# EAGLE design MainControl Board (EAGLE 8.6.0)
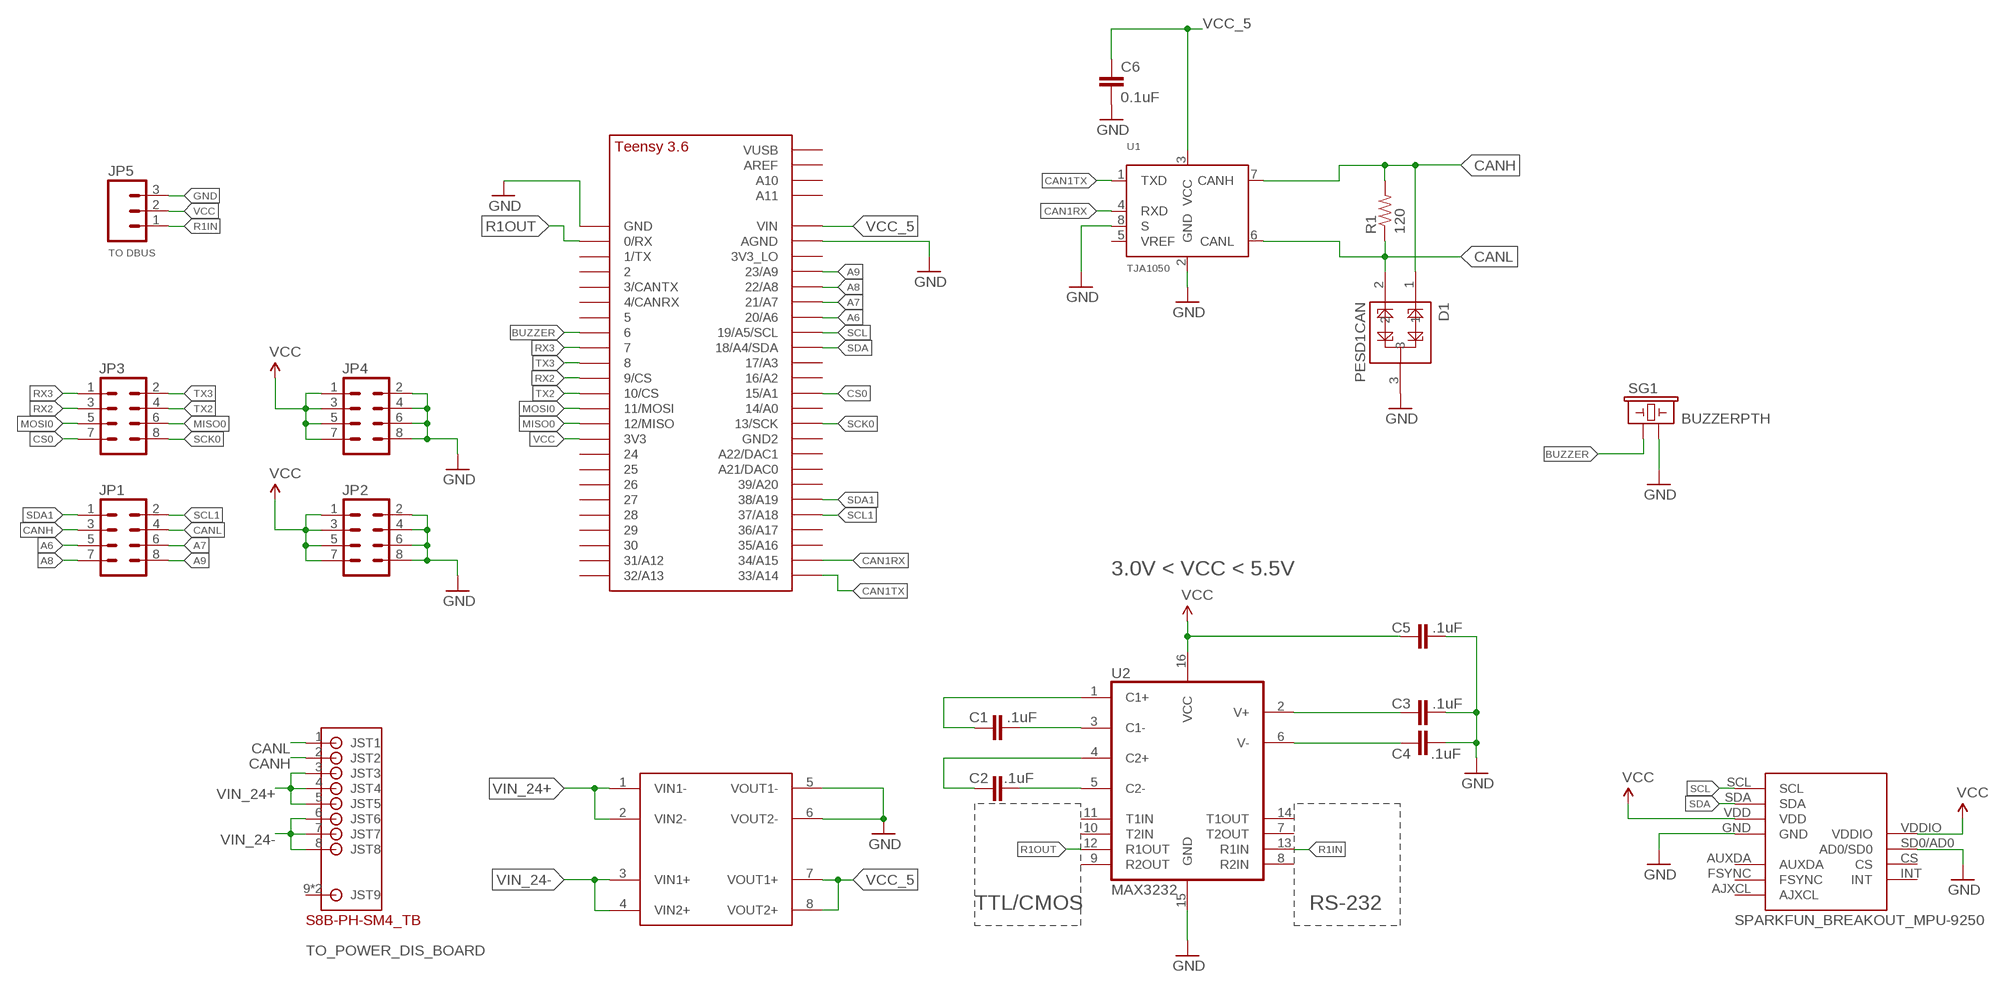
[diagram p0: schematic, sheet 1]

## Parts
C1  .1uF  0.1UF-25V(+80/-20%)(0603)  [0603-CAP]
C2  .1uF  0.1UF-25V(+80/-20%)(0603)  [0603-CAP]
C3  .1uF  0.1UF-25V(+80/-20%)(0603)  [0603-CAP]
C4  .1uF  0.1UF-25V(+80/-20%)(0603)  [0603-CAP]
C5  .1uF  0.1UF-25V(+80/-20%)(0603)  [0603-CAP]
C6  0.1uF  0.1UF-25V(+80/-20%)(0603)  [0603-CAP]
D1  PESD1CAN  [SOT23-3]
JP1  M04X2  [2X4]
JP2  M04X2  [2X4]
JP3  M04X2  [2X4]
JP4  M04X2  [2X4]
JP5  M03JST-PTH-VERT  [JST-3-PTH-VERT]
R1  120  0.22OHM-1/4W-1%(0805)  [0805]
SG1  BUZZERPTH  [BUZZER-12MM]
U1  TJA1050  [SOT96-1]
U2  MAX3232  MAX232SOIC16  [SO016]
U$1  TEENSY_3.5/3.6_BASIC  [TEENSY_3.5/3.6_BASIC]
U$2  MP1584  [MP1584_AMAZON]
U$3  S8B-PH-SM4_TB  [S8B-PH-SM4_TB]
U$4  SPARKFUN_BREAKOUT_MPU-9250  [SPARKFUN_BREAKOUT_MPU-9250]

## Nets
A6: JP1.5 U$1.20/A6
A7: JP1.6 U$1.21/A7
A8: JP1.7 U$1.22/A8
A9: JP1.8 U$1.23/A9
BUZZER: SG1.+ U$1.6
C1+: C1.1 U2.1(C1+)
C1-: C1.2 U2.3(C1-)
C2+: C2.1 U2.4(C2+)
C2-: C2.2 U2.5(C2-)
CAN1RX: U1.4(RXD) U$1.34/A15
CAN1TX: U1.1(TXD) U$1.33/A14
CANH: D1.1 JP1.3 R1.2 U1.7(CANH) U$3.2(JST2)
CANL: D1.2 JP1.4 R1.1 U1.6(CANL) U$3.1(JST1)
CS0: JP3.7 U$1.15/A1
GND: C3.2 C4.2 C5.2 C6.2 D1.3 JP2.2 JP2.4 JP2.6 JP2.8 JP4.2 JP4.4 JP4.6 JP4.8 JP5.3 SG1.- U1.2(GND) U1.8(S) U2.15(GND) U$1.AGND U$1.GND U$2.5(VOUT1-) U$2.6(VOUT2-) U$4.GND U$4.SD0/AD0(AD0/SD0)
MISO0: JP3.6 U$1.12/MISO
MOSI0: JP3.5 U$1.11/MOSI
R1IN: JP5.1 U2.13(R1IN)
R1OUT: U2.12(R1OUT) U$1.0/RX
RX2: JP3.3 U$1.9/CS
RX3: JP3.1 U$1.7
SCK0: JP3.8 U$1.13/SCK
SCL: U$1.19/A5/SCL U$4.SCL
SCL1: JP1.2 U$1.37/A18
SDA: U$1.18/A4/SDA U$4.SDA
SDA1: JP1.1 U$1.38/A19
TX2: JP3.4 U$1.10/CS
TX3: JP3.2 U$1.8
V+: C3.1 U2.2(V+)
V-: C4.1 U2.6(V-)
VCC: C5.1 JP2.1 JP2.3 JP2.5 JP2.7 JP4.1 JP4.3 JP4.5 JP4.7 JP5.2 U2.16(VCC) U$1.3V3 U$4.VDD U$4.VDDIO
VCC_5: C6.1 U1.3(VCC) U$1.VIN U$2.7(VOUT1+) U$2.8(VOUT2+)
VIN_24+: U$2.1(VIN1-) U$2.2(VIN2-) U$3.3(JST3) U$3.4(JST4) U$3.5(JST5)
VIN_24-: U$2.3(VIN1+) U$2.4(VIN2+) U$3.6(JST6) U$3.7(JST7) U$3.8(JST8)
Unconnected: U1.5(VREF) U2.7(T2OUT) U2.8(R2IN) U2.9(R2OUT) U2.10(T2IN) U2.11(T1IN) U2.14(T1OUT) U$1.1/TX U$1.2 U$1.3/CANTX U$1.3V3_LO U$1.4/CANRX U$1.5 U$1.14/A0 U$1.16/A2 U$1.17/A3 U$1.21/DAC0(A21/DAC0) U$1.24 U$1.25 U$1.26 U$1.27 U$1.28 U$1.29 U$1.30 U$1.31/A12 U$1.32/A13 U$1.35/A16 U$1.36/A17 U$1.39/A20 U$1.A10 U$1.A11 U$1.A22/DAC1 U$1.AREF U$1.GND2 U$1.VUSB U$3.9(JST9) U$3.10(JST9) U$4.AJXCL U$4.AUXDA U$4.CS U$4.FSYNC U$4.INT

## Notes on the sheet
- TO DBUS
- 3.0V < VCC < 5.5V
- TTL/CMOS | RS-232
- TO_POWER_DIS_BOARD

## Library data of the parts
C1-C5 = SparkFun-Capacitors:0.1UF-25V(+80/-20%)(0603): CAP-00810 Ceramic Standard decoupling cap; PROD_ID: CAP-00810; SPARKLE_ID: 918; VALUE: 0.1uF
C6 = SparkFun-Capacitors:0.1UF-25V(+80/-20%)(0603): CAP-00810 Ceramic Standard decoupling cap; PROD_ID: CAP-00810
D1 = SparkFun-DiscreteSemi:PESD1CAN: PESD1CAN is used to protect two automotive CAN bus lines from ESD.; PROD_ID: DIO-12501
JP1-JP4 = SparkFun-Connectors:M04X2: .1" header, two rows of four.
JP5 = SparkFun-Connectors:M03: Header 3 Standard 3-pin 0.1" header. Use with straight break away headers (SKU : PRT-00116), right angle break away headers (PRT-00553), swiss pins (PRT-00743), machine pins (PRT-00117), and female headers (PRT-00115). Molex polarized connector foot print use with SKU : PRT-08232 with associated crimp pins and housings.
R1 = SparkFun-Resistors:0.22OHM-1/4W-1%(0805): RES-09883; PROD_ID: RES-09883; VALUE: 0.22
SG1 = SparkFun-Electromechanical:BUZZER: Buzzer 12mm Spark Fun Electronics SKU : Comp-Buzzer
U1 = TJA1050:TJA1050: High speed CAN transceiver The TJA1050 is the interface between the Controller Area Network (CAN) protocol controller and the physical bus. The device provides differential transmit capability to the bus and differential receive capability to the CAN controller. The TJA1050 is the third Philips high-speed CAN transceiver after the PCA82C250 and the PCA82C251. The most important differences are: Much lower electromagnetic emission due to optimal matching of the output signals CANH and CANL Improved behaviour in case of an unpowered node No standby mode. This makes the TJA1050 eminently suitable for use in nodes that are in a power-down situation in partially powered networks. AAL Eindhoven MK; AVAILABILITY: Unavailable; MF: NXP Semiconductors; MP: TJA1050; PACKAGE: None; PRICE: 0.32 USD
U2 = SparkFun-DigitalIC:MAX232: RS232 Transceiver Very common IC. This is generically called 'MAX232', but works with the 3V equivalent MAX3232 generic ICs. Field tested and mother approved. Spark Fun Electronics SKU : COM-00316 (DIP) and COM-00589 (SMD); PROD_ID: IC-08171
U$1 = Teensy356:TEENSY_3.5/3.6_BASIC
U$2 = MP1584BUCK:MP1584
U$3 = KevinMade:S8B-PH-SM4_TB
U$4 = KevinMade:SPARKFUN_BREAKOUT_MPU-9250

## Net classes
0 default: width 0.305 mm, drill 0.508 mm, clearance 0.254 mm

## Board
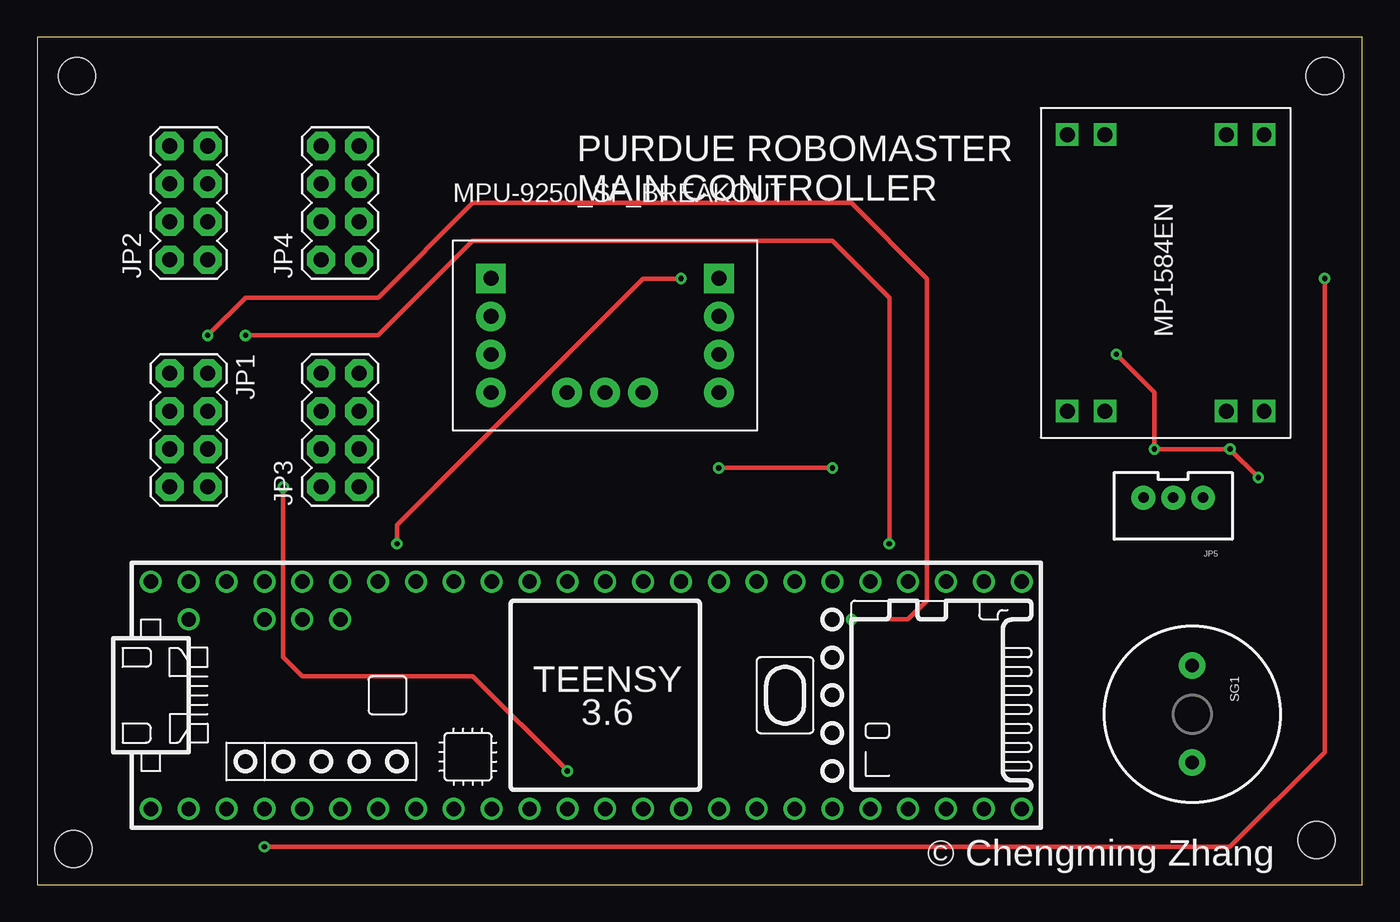
[diagram p1: board, top side]
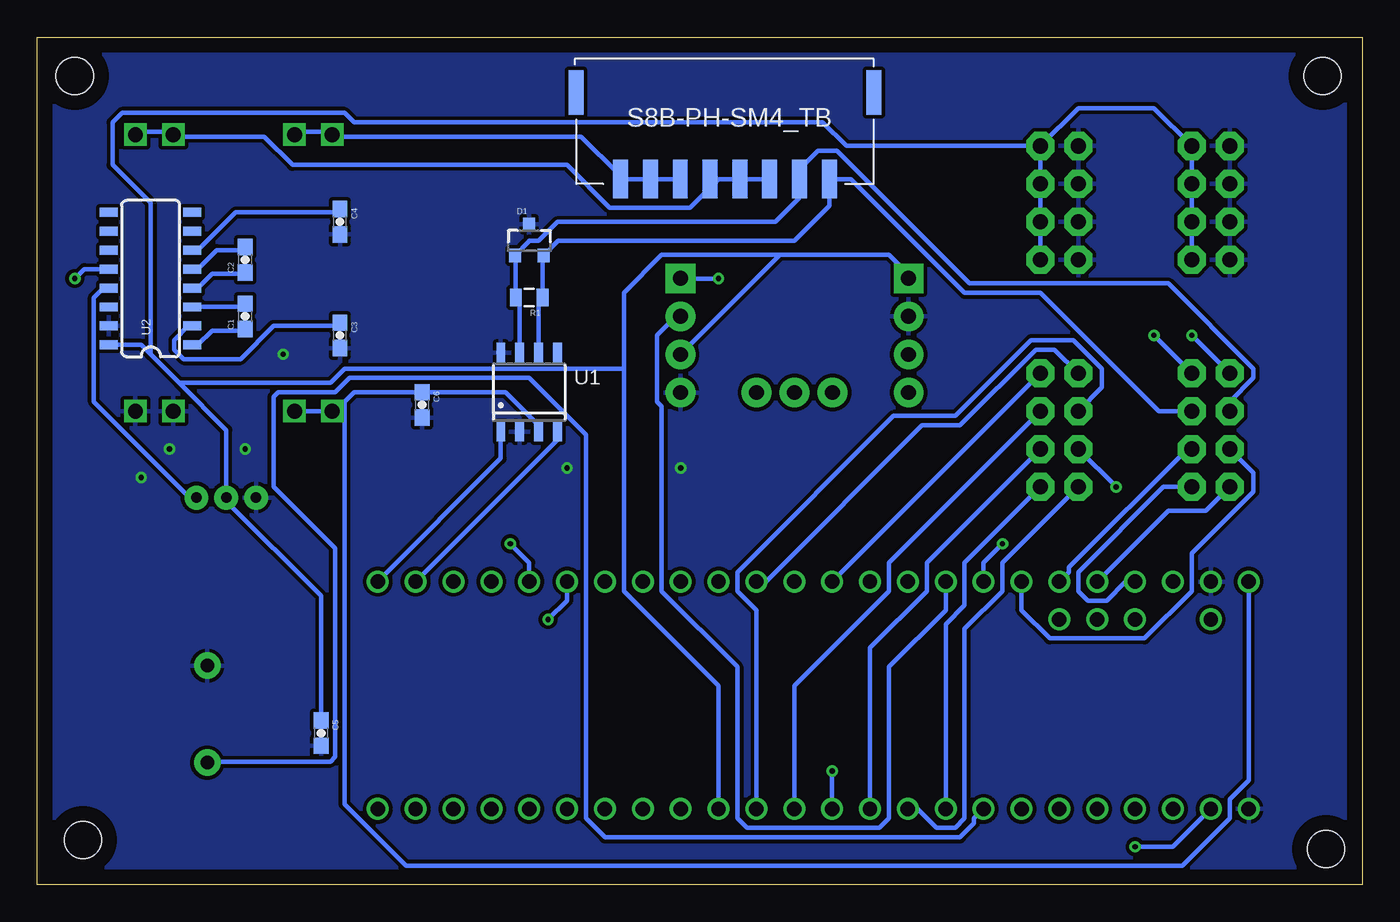
[diagram p2: board, bottom side, seen from below]

Size 88.88 x 56.82 mm. Coordinates in mm from the lower left corner, seen from the top.
Outline: 0,0 88.88,0 88.88,56.82 0,56.82 0,0
Copper layers (1*16): Top 0.035mm / dielectric 1.5mm / Bottom 0.035mm
Design rules "default *": minimum track width 6mil, minimum drill 0.35mm, track to track 10mil, track to pad 10mil, pad to pad 10mil, via to via 10mil, smd to smd 6mil, copper to edge 40mil, drill to drill 6mil, minimum pad ring 10mil, minimum via ring 8mil, stop-mask expansion 4mil, vias tented up to drill 0mil, thermal gap 10mil
Holes 2.5 mm at 2.43,2.39 85.81,2.99 2.67,54.23 86.36,54.23

### Footprints (pad centres in the part's own frame; a part is rotated, then mirrored left to right if it is on the bottom)
0603-CAP = smd 1.1 x 1: 1 -0.85,0; 2 0.85,0
SOT23-3 = smd 0.8 x 0.9: 1 -0.95,-1; 2 0.95,-1; 3 0,1.1
2X4 = drill 1.016 pad 1.88 octagon: 1 -3.81,-1.27; 2 -3.81,1.27; 3 -1.27,-1.27; 4 -1.27,1.27; 5 1.27,-1.27; 6 1.27,1.27; 7 3.81,-1.27; 8 3.81,1.27
JST-3-PTH-VERT = drill 0.7 pad 1.6: 1 -2,-0.55; 2 0,-0.55; 3 2,-0.55
0805 = smd 0.8 x 1.2: 1 -0.9,0; 2 0.9,0
BUZZER-12MM = drill 0.9 pad 1.778: + 3.25,0; - -3.25,0
SOT96-1 = smd 0.6 x 1.3: 1 -1.905,-2.65; 2 -0.635,-2.65; 3 0.635,-2.65; 4 1.905,-2.65; 5 1.905,2.65; 6 0.635,2.65; 7 -0.635,2.65; 8 -1.905,2.65
SO016 = smd 0.6 x 1.2: 1 -4.445,-2.8; 2 -3.175,-2.8; 3 -1.905,-2.8; 4 -0.635,-2.8; 5 0.635,-2.8; 6 1.905,-2.8; 7 3.175,-2.8; 8 4.445,-2.8; 9 4.445,2.8; 10 3.175,2.8; 11 1.905,2.8; 12 0.635,2.8; 13 -0.635,2.8; 14 -1.905,2.8; 15 -3.175,2.8; 16 -4.445,2.8
TEENSY_3.5/3.6_BASIC = drill 0.965: 0/RX -25.4,-7.62; 1/TX -22.86,-7.62; 2 -20.32,-7.62; 3/CANTX -17.78,-7.62; 3V3 7.62,-7.62; 3V3_LO -22.86,7.62; 4/CANRX -15.24,-7.62; 5 -12.7,-7.62; 6 -10.16,-7.62; 7 -7.62,-7.62; 8 -5.08,-7.62; 9/CS -2.54,-7.62; 10/CS 0,-7.62; 11/MOSI 2.54,-7.62; 12/MISO 5.08,-7.62; 13/SCK 5.08,7.62; 14/A0 2.54,7.62; 15/A1 0,7.62; 16/A2 -2.54,7.62; 17/A3 -5.08,7.62; 18/A4/SDA -7.62,7.62; 19/A5/SCL -10.16,7.62; 20/A6 -12.7,7.62; 21/A7 -15.24,7.62; 21/DAC0 12.7,7.62; 22/A8 -17.78,7.62; 23/A9 -20.32,7.62; 24 10.16,-7.62; 25 12.7,-7.62; 26 15.24,-7.62; 27 17.78,-7.62; 28 20.32,-7.62; 29 22.86,-7.62; 30 25.4,-7.62; 31/A12 27.94,-7.62; 32/A13 30.48,-7.62; 33/A14 30.48,7.62; 34/A15 27.94,7.62; 35/A16 25.4,7.62; 36/A17 22.86,7.62; 37/A18 20.32,7.62; 38/A19 17.78,7.62; 39/A20 15.24,7.62; A10 -17.78,5.08; A11 -15.24,5.08; A22/DAC1 10.16,7.62; AGND -25.4,7.62; AREF -20.32,5.08; GND -27.94,-7.62; GND2 7.62,7.62; VIN -27.94,7.62; VUSB -25.4,5.08
MP1584_AMAZON = drill 1 square: 1 1.778,14.986; 2 1.778,12.446; 3 1.778,4.318; 4 1.778,1.778; 5 20.32,14.986; 6 20.32,12.446; 7 20.32,4.318; 8 20.32,1.778
S8B-PH-SM4_TB = smd 1 x 2.6: 1 4,7.3; 2 6,7.3; 3 8,7.3; 4 10,7.3; 5 12,7.3; 6 14,7.3; 7 16,7.3; 8 18,7.3 | smd 1 x 3: 9 1.016,1.5; 10 20.984,1.5
SPARKFUN_BREAKOUT_MPU-9250 = drill 1 pad 2: AJXCL 5.1,-7.65; AUXDA 5.1,-2.55; CS 2.55,-12.75; FSYNC 5.1,-5.1; GND 5.1,2.55; INT 5.1,-12.75; SD0/AD0 0,-12.75; SDA 0,2.55; VDD 2.55,2.55 | drill 1 pad 2 square: SCL -2.55,2.55; VDDIO -2.55,-12.75

### Placement (x,y rotation side)
C1  74.93,38.1 90 bottom
C2  74.93,41.91 90 bottom
C3  68.58,36.83 270 bottom
C4  68.58,44.45 270 bottom
C5  69.85,10.16 270 bottom
C6  63.07,32.17 270 bottom
D1  55.88,43.18 0 bottom
JP1  10.16,30.48 270 top
JP2  10.16,45.72 90 top
JP3  20.32,30.48 90 top
JP4  20.32,45.72 90 top
JP5  76.2,25.4 180 top
R1  55.88,39.37 180 bottom
SG1  77.47,11.43 270 top
U1  55.88,33.02 0 bottom
U2  81.28,40.64 90 bottom
U$1  35.56,12.7 0 top
U$2  67.31,52.07 270 top
U$3  31.75,54.61 180 bottom
U$4  43.18,38.1 270 top

### Tracks (layer width: path | path; a pad name or v marks a point on that pad's centre or on a via)
A6
  Bottom 0.305: U$1.20/A6 22.86,18.41 20.95,16.51 14.61,16.51 11.43,19.68 11.43,22.22 7.3,26.35 7.3,27.62 JP1.5
A7
  Bottom 0.305: U$1.21/A7 19.68,20.95 19.68,21.27 11.75,29.21 JP1.6
A8
  Bottom 0.305: JP1.7 10.48,25.08 13.02,25.08 U$1.22/A8
A9
  Bottom 0.305: U$1.23/A9 15.88,20.32 17.14,19.05 18.41,19.05 19.05,19.68 19.05,20.95 13.34,26.67 JP1.8
BUZZER
  Bottom 0.305: U$1.6 26.04,4.45 26.04,4.13 26.99,3.17 50.8,3.17 52.07,4.45 52.07,30.16 55.88,33.97 62.4,33.97 62.4,33.98 67.94,33.98 68.9,33.02 72.71,33.02 73.03,32.7 73.03,26.67 68.9,22.54 68.9,8.57 69.22,8.26 77.47,8.26 SG1.+
C1+
  Bottom 0.305: U2.1 78.11,36.2 77.15,37.15 74.93,37.15 C1.1
C1-
  Bottom 0.305: U2.3 74.93,38.74 C1.2
C2+
  Bottom 0.305: U2.4 78.11,40.01 77.15,40.96 74.93,40.96 C2.1
C2-
  Bottom 0.305: U2.5 78.11,41.28 76.84,42.55 74.93,42.55 C2.2
CAN1RX
  Bottom 0.305: U1.4 53.98,29.84 U$1.34/A15
CAN1TX
  Bottom 0.305: U1.1 57.78,28.57 U$1.33/A14
CANH
  Bottom 0.305: JP1.3 8.89,32.38 7.3,33.97 7.3,34.61 13.02,40.32 26.35,40.32 35.24,49.21 36.51,49.21 37.46,48.26 37.46,47.62 U$3.2 37.75,46.07 39.37,44.45 53.98,44.45 55.24,43.18 55.88,43.18 55.88,43.13 D1.1 56.83,41.96 56.78,41.91 R1.2 56.52,39.11 U1.7
CANL
  Bottom 0.305: JP1.4 13.65,31.75 21.59,39.69 26.67,39.69 34.29,47.31 35.56,47.31 U$3.1 35.75,45.53 38.1,43.18 53.93,43.18 D1.2 54.98,42.13 R1.1 55.24,39.11 U1.6
CS0
  Bottom 0.305: JP3.7 U$1.15/A1
GND  (via drill 0.35)
  Top 0.305: v45.72,27.94 v53.34,27.94 | v81.92,27.3 v80.01,29.21 v74.93,29.21 74.93,33.02 v72.39,35.56
  pour Bottom: -1.27,57.15 -1.27,-1.27 90.17,-1.27 90.17,57.15
MISO0
  Bottom 0.305: U$1.12/MISO 40.64,18.41 41.91,19.68 41.91,20.95 31.43,31.43 27.3,31.43 22.22,36.51 19.37,36.51 17.46,34.61 17.46,33.34 JP3.6
MOSI0
  Bottom 0.305: U$1.11/MOSI 38.1,13.33 31.75,19.68 31.75,21.59 JP3.5
R1IN
  Bottom 0.305: U2.13 84.46,40.01 85.09,39.37 85.09,32.38 78.42,25.72 JP5.1
R1OUT  (via drill 0.35)
  Top 0.305: v15.24,2.54 80.01,2.54 86.36,8.89 v86.36,40.64
  Bottom 0.305: U$1.0/RX 12.7,2.54 v15.24,2.54 | v86.36,40.64 85.73,41.28 U2.12
RX2
  Bottom 0.305: U$1.9/CS 33.02,15.88 29.21,19.68 29.21,21.59 JP3.3
RX3
  Bottom 0.305: U$1.7 27.94,17.46 26.67,18.73 26.67,21.59 JP3.1
SCK0
  Bottom 0.305: U$1.13/SCK 40.01,20.32 29.53,30.8 26.99,30.8 21.91,35.88 20.64,35.88 JP3.8
SCL  (via drill 0.35)
  Top 0.305: v24.13,22.86 24.13,24.13 40.64,40.64 v43.18,40.64
  Bottom 0.305: U$1.19/A5/SCL 25.4,21.59 v24.13,22.86 | v43.18,40.64 U$4.SCL
SCL1  (via drill 0.35)
  Top 0.305: v57.15,22.86 57.15,39.37 53.34,43.18 29.21,43.18 22.86,36.83 v13.97,36.83
  Bottom 0.305: JP1.2 v13.97,36.83 | U$1.37/A18 55.88,21.59 v57.15,22.86
SDA
  Bottom 0.305: U$1.18/A4/SDA 27.94,18.41 31.75,14.61 31.75,4.45 32.38,3.81 41.27,3.81 41.91,4.45 41.91,14.61 46.99,19.68 46.99,32.07 47.31,32.38 47.31,36.83 46.04,38.1 U$4.SDA
SDA1  (via drill 0.35)
  Top 0.305: v54.61,17.78 58.42,17.78 59.69,19.05 59.69,40.64 54.61,45.72 29.21,45.72 22.86,39.37 13.97,39.37 v11.43,36.83
  Bottom 0.305: JP1.1 v11.43,36.83 | U$1.38/A19 53.34,19.05 v54.61,17.78
TX2  (via drill 0.35)
  Top 0.305: v35.56,7.62 29.21,13.97 17.78,13.97 16.51,15.24 v16.51,26.67
  Bottom 0.305: U$1.10/CS v35.56,7.62 | v16.51,26.67 JP3.4
TX3
  Bottom 0.305: U$1.8 29.84,5.08 28.57,3.81 27.3,3.81 26.67,4.45 26.67,17.14 24.13,19.68 24.13,21.59 JP3.2
V+
  Bottom 0.305: C3.1 68.58,37.47 73.03,37.47 75.25,35.24 79.06,35.24 79.69,35.88 79.69,36.51 78.74,37.47 U2.2
V-
  Bottom 0.305: U2.6 78.11,42.55 75.57,45.09 68.58,45.09 C4.1
VCC
  Bottom 0.305: U$1.3V3 43.18,13.33 49.53,19.68 49.53,34.61 | 49.53,34.61 49.53,39.69 46.99,42.23 39.05,42.23 | 39.05,42.23 31.75,42.23 30.48,40.96 U$4.VDDIO | 39.05,42.23 U$4.VDD | JP2.1 JP2.3 JP2.5 JP2.7 13.97,52.07 19.05,52.07 JP4.7 | JP4.1 JP4.3 JP4.5 JP4.7 | C5.1 69.85,19.37 76.2,25.72 JP5.2 76.2,30.48 79.38,33.66 | U2.16 81.92,36.2 81.28,35.56 | 79.38,33.66 81.28,35.56 | JP4.7 34.61,49.53 36.2,51.12 67.63,51.12 68.26,51.75 83.19,51.75 83.82,51.12 83.82,48.26 81.28,45.72 81.28,35.56 | 79.38,33.66 69.22,33.66 68.26,34.61 49.53,34.61
VCC_5
  Bottom 0.305: 68.26,32.38 68.9,31.75 U$2.8 U$2.7 | 68.26,32.38 67.63,33.02 C6.1 57.47,33.02 55.24,30.8 U1.3 | U$1.VIN 7.62,6.98 8.89,5.71 8.89,4.45 12.07,1.27 64.14,1.27 68.26,5.4 68.26,32.38
VIN_24+
  Bottom 0.305: U$2.1 82.23,50.48 80.01,50.48 U$2.2 79.69,50.17 73.66,50.17 71.76,48.26 53.34,48.26 50.48,45.4 45.09,45.4 43.18,47.31 | U$3.3 40.01,47.31 41.59,47.31 U$3.4 41.91,47.31 43.18,47.31 | 43.18,47.31 43.5,47.31 U$3.5
VIN_24-
  Bottom 0.305: U$2.3 71.44,50.48 69.22,50.48 U$2.4 68.9,50.17 52.39,50.17 49.85,47.62 U$3.8 49.53,47.31 47.94,47.31 U$3.7 47.62,47.31 46.04,47.31 U$3.6

### Text on the board
tPlace: PURDUE ROBOMASTER / MAIN CONTROLLER | © Chengming Zhang